# Altium schematic sheet [05] Data.SchDoc: DATA
size A4
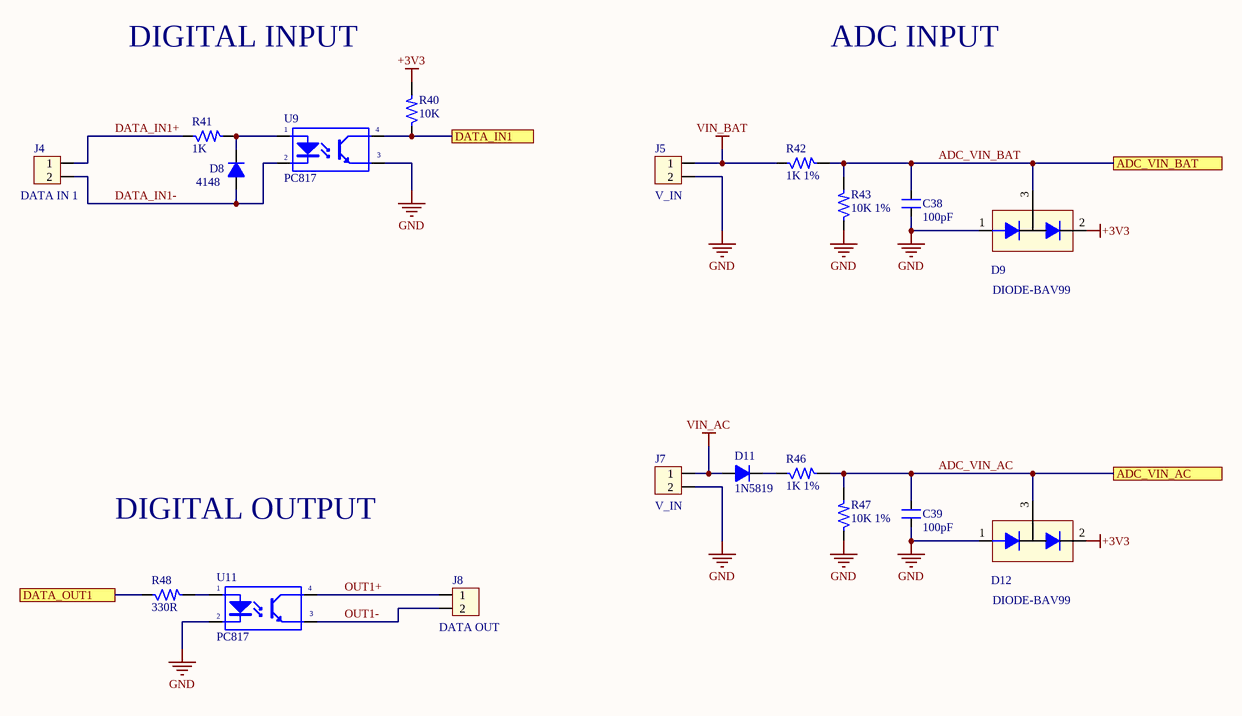
[diagram p0: [05] Data.SchDoc]

## Parts
C38  100pF  [C0603 SMT]
C39  100pF  [C0603 SMT]
D8  4148  [DO-4148 SMD]
D9  DIODE-BAV99  [SOT23]
D11  1N5819  [SOD123]
D12  DIODE-BAV99  [SOT23]
J4  DATA IN 1  [CON_2.54mm_2]
J5  V_IN  [CON_2.54mm_2]
J7  V_IN  [CON_2.54mm_2]
J8  DATA OUT  [CON_2.54mm_2]
R40  10K  [R0603 -SMT]
R41  1K  [R0603 -SMT]
R42  1K 1%  [R0603 -SMT]
R43  10K 1%  [R0603 -SMT]
R46  1K 1%  [R0603 -SMT]
R47  10K 1%  [R0603 -SMT]
R48  330R  [R0603 -SMT]
U9  PC817  [SOP-4-B]
U11  PC817  [SOP-4-B]

## Ports
ADC_VIN_AC, ADC_VIN_BAT, DATA_IN1, DATA_OUT1

## Nets
+3V3: D9.2 D12.2 R40.2
GND: C38.1 C39.1 D9.1 D12.1 J5.2 J7.2 R43.1 R47.1 U9.3(E) U11.2(K)
VIN_AC: D11.1(A) J7.1
VIN_BAT: J5.1 R42.1
ADC_VIN_AC: C39.2 D12.3 R46.2 R47.2 ; port ADC_VIN_AC
ADC_VIN_BAT: C38.2 D9.3 R42.2 R43.2 ; port ADC_VIN_BAT
DATA_IN1: R40.1 U9.4(C) ; port DATA_IN1
DATA_IN1+: J4.1 R41.1
DATA_IN1-: D8.1(A) J4.2 U9.2(K)
DATA_OUT1: R48.1 ; port DATA_OUT1
OUT1+: J8.1 U11.4(C)
OUT1-: J8.2 U11.3(E)
NetD8_2: D8.2(K) R41.2 U9.1(A)
NetD11_2: D11.2(K) R46.1
NetR48_2: R48.2 U11.1(A)

## Notes on the sheet
- DIGITAL INPUT
- ADC INPUT
- DIGITAL OUTPUT
- Title
- Size:
- Date:
- A4
- Number:
- Time:
- Revision:
- Sheet
- of
- File:

## Library data of the parts
C38 C39 = CM: Cap SMD; Value: 103
D8 D11 = D1A: Diode 1A; Value: 1N4007
D9 D12 = DIODE-BAV99: ZENER, SOT23,; Manufacturer: ON Semiconductor / Fairchild; Manufacturer Part Number: BAV99; .Creator: LeKhaLinh; Other Drawings: Diode Circuit; PCN Design/Specification: Mold Compound 12/Dec/2007; PCN Assembly/Origin: SOT23 Manufacturing Source 31/May2013 / Assembly Site Addition 20/Jul/2015; PCN Packaging: Binary Year Code Marking 15/Jan/2014; Diode Configuration: 1 Pair Series Connection; Diode Type: Standard; Voltage - DC Reverse (Vr) (Max): 70V; Current - Average Rectified (Io) (per Diode): 200mA; Voltage - Forward (Vf) (Max) @ If: 1.25V @ 150mA; Speed: Small Signal =; Reverse Recovery Time (trr): 6ns; Current - Reverse Leakage @ Vr: 2.5µA @ 70V; Online Catalog: Diode Array; Other Names: BAV99FSDKR; .CheckPCB: LeKhaLinh; .CheckSCH: LeKhaLinh; Supplier 1: Digi-Key; Stock 1: 1165; Pricing 1: 1=0.26, 10=0.21, 100=0.1115, 500=0.0734, 1000=0.0499 (USD); Standard Package: 1; Category: Discrete Semiconductor Products; Family: Diodes, Rectifiers - Arrays; Packaging: Digi-Reel®; Mounting Type: Surface Mount; Package / Case: TO-236-3, SC-59, SOT-23-3; Supplier Device Package: SOT-23-3 (TO-236); ComponentLink1URL: https://www.fairchildsemi.com/package-drawings/MA/MA03B.pdf?src-supplier=Digi-Key; ComponentLink1Description: https://www.fairchildsemi.com/package-drawings/MA/MA03B.pdf?src-supplier=Digi-Key; ComponentLink2URL: http://www.farnell.com/datasheets/1822674.pdf?src-supplier=Element14; ComponentLink2Description: http://www.farnell.com/datasheets/1822674.pdf?src-supplier=Element14; ComponentLink3URL: http://www.mouser.com/ds/2/149/BAV99-22788.pdf?src-supplier=Mouser; ComponentLink3Description: http://www.mouser.com/ds/2/149/BAV99-22788.pdf?src-supplier=Mouser; ComponentLink4URL: http://www.fairchildsemi.com/ds/BA/BAV99.pdf?src-supplier=Avnet+Europe; ComponentLink4Description: http://www.fairchildsemi.com/ds/BA/BAV99.pdf?src-supplier=Avnet+Europe; ComponentLink5URL: https://www.verical.com/server-webapp/html/getDatasheet?partID=110217&src-supplier=Verical; ComponentLink5Description: https://www.verical.com/server-webapp/html/getDatasheet?partID=110217&src-supplier=Verical; ComponentLink6URL: http://www.farnell.com/datasheets/2304409.pdf?src-supplier=Element14; ComponentLink6Description: http://www.farnell.com/datasheets/2304409.pdf?src-supplier=Element14; Supplier 2: Mouser; Stock 2: 0; Supplier 3: Arrow; Stock 3: 5700; Pricing 3: 1=0.1933, 10=0.1873, 25=0.1555, 100=0.0806, 250=0.0724, 500=0.0523, 1000=0.0428, 3000=0.0342 (USD); Supplier Part Number 1: BAV99FSCT-ND; Supplier Part Number 2: 512-BAV99; Supplier Part Number 3: BAV99
J4 J5 J7 J8 = Con2: Connector 2; Value: Connector 2
R40 R43 R47 R48 = RM: Resistor SMD; Value: 1K
R41 R42 R46 = RM: Resistor SMD; Value: 1K
U9 U11 = PC817: Single Opto; Value: PC817